# Altium schematic sheet Stabilizer_Piezo_Driver.SchDoc: Stabilizer Piezo
size 420 x 297 mm; CheckedBy: G. Kasprowicz; Author: Jakub Kajzer; CompanyName: WUT ISE; DrawnBy: Jakub Kajzer; Organization: WUT ISE; Address1: PW ISE; Address2: Nowowiejska 15/19 00-665 Warsaw; Address3: gkasprow@gmail.com; DocumentNumber: 1; Revision: 2; SheetNumber: 1; SheetTotal: 7; ModifiedBy: -; CreateDate: 03.08.2020; CheckedDate: -; Title2: Driver mezzanine; DivGrp: WUT ISE; Designer: Jakub Kajzer; ModifiedDate: -; ProjectName: Sensor Box
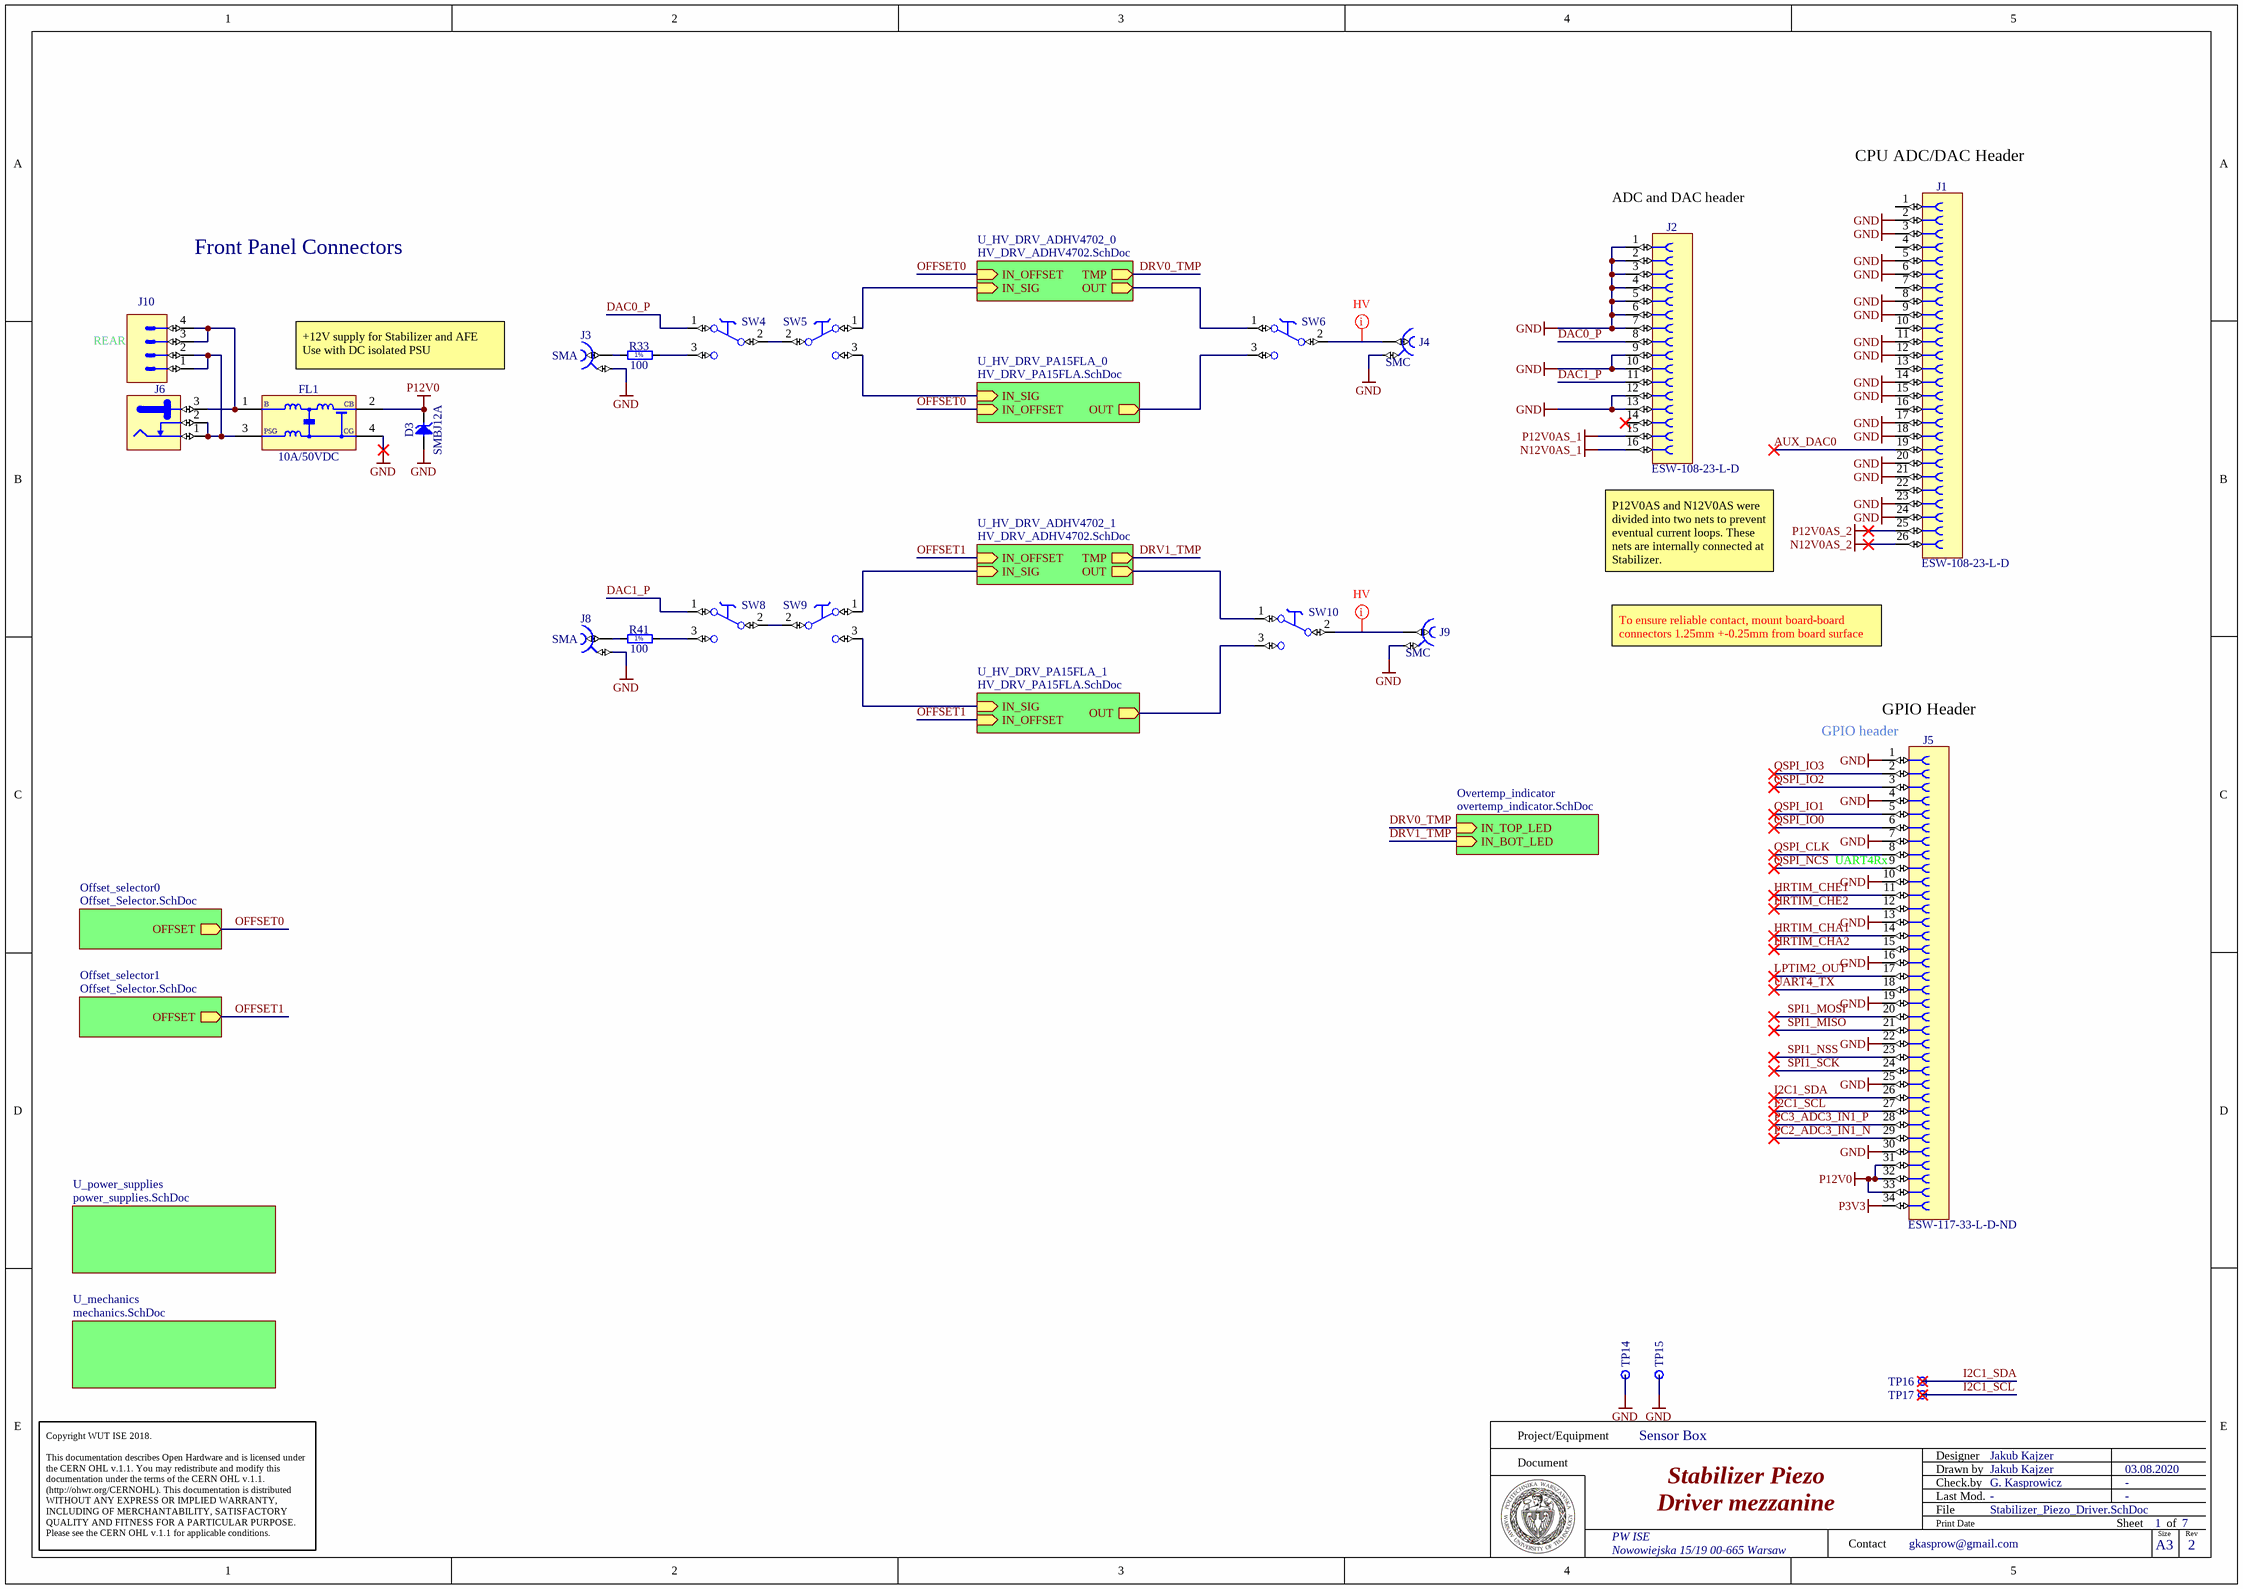
[diagram p0: Stabilizer_Piezo_Driver.SchDoc]

## Parts
D3  SMBJ12A  [DIOM5336X265N]
FL1  10A/50VDC  [FIL_MURATA_BNX02]
J1  ESW-108-23-L-D  [ESW-113-23-L-D]
J2  ESW-108-23-L-D  [ESW-108-23-L-D]
J3  SMA  [RF249BT0050GHDW]
J4  SMC  [JOHNSON_131-6701-341]
J5  Manufacturer Part Number: ESW-117-33-L-D-ND  [ESW-117-23-L-D]  (hidden comment: ESW-108-23-L-D)
J6  Jack  [SWITCHCRAFT_L712RA]  (value not drawn)
J8  SMA  [RF249BT0050GHDW]
J9  SMC  [JOHNSON_131-6701-341]
J10  Mini-Fit Jr.™  [MOLEX_39-30-0040]  (value not drawn)
R33  100  [RESC1005X40N]
R41  100  [RESC1005X40N]
SW4  Switch  [SW_C&K_1101M2S3CQE2]  (value not drawn)
SW5  Switch  [SW_C&K_1101M2S3CQE2]  (value not drawn)
SW6  Switch  [SW_C&K_1101M2S3CQE2]  (value not drawn)
SW8  Switch  [SW_C&K_1101M2S3CQE2]  (value not drawn)
SW9  Switch  [SW_C&K_1101M2S3CQE2]  (value not drawn)
SW10  Switch  [SW_C&K_1101M2S3CQE2]  (value not drawn)
TP14  Test Point  [TPS127]  (value not drawn)
TP15  Test Point  [TPS127]  (value not drawn)
TP16  Test Point  [TPS127]  (value not drawn)
TP17  Test Point  [TPS127]  (value not drawn)

## Sub-sheets
Offset_selector0 = Offset_Selector.SchDoc: OFFSET (out)
Offset_selector1 = Offset_Selector.SchDoc: OFFSET (out)
Overtemp_indicator = overtemp_indicator.SchDoc: IN_TOP_LED (in), IN_BOT_LED (in)
U_HV_DRV_ADHV4702_0 = HV_DRV_ADHV4702.SchDoc: OUT (out), TMP (out), IN_SIG (in), IN_OFFSET (in)
U_HV_DRV_ADHV4702_1 = HV_DRV_ADHV4702.SchDoc: OUT (out), TMP (out), IN_SIG (in), IN_OFFSET (in)
U_HV_DRV_PA15FLA_0 = HV_DRV_PA15FLA.SchDoc: OUT (out), IN_SIG (in), IN_OFFSET (in)
U_HV_DRV_PA15FLA_1 = HV_DRV_PA15FLA.SchDoc: OUT (out), IN_OFFSET (in), IN_SIG (in)
U_mechanics = mechanics.SchDoc: no entries
U_power_supplies = power_supplies.SchDoc: no entries

## Nets
GND: D3.2(A) FL1.4(CG) J1.2 J1.3 J1.5 J1.6 J1.8 J1.9 J1.11 J1.12 J1.14 J1.15 J1.17 J1.18 J1.20 J1.21 J1.23 J1.24 J2.1 J2.2 J2.3 J2.4 J2.5 J2.6 J2.7 J2.9 J2.10 J2.12 J2.13 J3.2 J4.2 J5.1 J5.4 J5.7 J5.10 J5.13 J5.16 J5.19 J5.22 J5.25 J5.30 J8.2 J9.2 TP14.1 TP15.1
N12V0AS_1: J2.16
N12V0AS_2: J1.26
P3V3: J5.34
P12V0: D3.1(C) FL1.2(CB) J5.31 J5.32 J5.33
P12V0AS_1: J2.15
P12V0AS_2: J1.25
AUX_DAC0: J1.19
DAC0_P: J2.8 SW4.1(NC)
DAC1_P: J2.11 SW8.1(NC)
DRV0_TMP: sheet Overtemp_indicator/IN_TOP_LED, sheet U_HV_DRV_ADHV4702_0/TMP
DRV1_TMP: sheet U_HV_DRV_ADHV4702_1/TMP, sheet Overtemp_indicator/IN_BOT_LED
HRTIM_CHA1: J5.14
HRTIM_CHA2: J5.15
HRTIM_CHE1: J5.11
HRTIM_CHE2: J5.12
I2C1_SCL: J5.27 TP17.1
I2C1_SDA: J5.26 TP16.1
LPTIM2_OUT: J5.17
OFFSET0: sheet U_HV_DRV_PA15FLA_0/IN_OFFSET, sheet Offset_selector0/OFFSET, sheet U_HV_DRV_ADHV4702_0/IN_OFFSET
OFFSET1: sheet U_HV_DRV_ADHV4702_1/IN_OFFSET, sheet U_HV_DRV_PA15FLA_1/IN_OFFSET, sheet Offset_selector1/OFFSET
PC2_ADC3_IN1_N: J5.29
PC3_ADC3_IN1_P: J5.28
QSPI_CLK: J5.8
QSPI_IO0: J5.6
QSPI_IO1: J5.5
QSPI_IO2: J5.3
QSPI_IO3: J5.2
QSPI_NCS: J5.9
SPI1_MISO: J5.21
SPI1_MOSI: J5.20
SPI1_NSS: J5.23
SPI1_SCK: J5.24
UART4_TX: J5.18
NetFL1_1: FL1.1(B) J6.3 J10.3 J10.4
NetFL1_3: FL1.3(PSG) J6.1 J6.2 J10.1 J10.2
NetJ3_1: J3.1 R33.1
NetJ4_1: J4.1 SW6.2(C)
NetJ8_1: J8.1 R41.1
NetJ9_1: J9.1 SW10.2(C)
NetR33_2: R33.2 SW4.3(NO)
NetR41_2: R41.2 SW8.3(NO)
NetSW4_2: SW4.2(C) SW5.2(C)
NetSW5_1: SW5.1(NC) ; sheet U_HV_DRV_ADHV4702_0/IN_SIG
NetSW5_3: SW5.3(NO) ; sheet U_HV_DRV_PA15FLA_0/IN_SIG
NetSW6_1: SW6.1(NC) ; sheet U_HV_DRV_ADHV4702_0/OUT
NetSW6_3: SW6.3(NO) ; sheet U_HV_DRV_PA15FLA_0/OUT
NetSW8_2: SW8.2(C) SW9.2(C)
NetSW9_1: SW9.1(NC) ; sheet U_HV_DRV_ADHV4702_1/IN_SIG
NetSW9_3: SW9.3(NO) ; sheet U_HV_DRV_PA15FLA_1/IN_SIG
NetSW10_1: SW10.1(NC) ; sheet U_HV_DRV_ADHV4702_1/OUT
NetSW10_3: SW10.3(NO) ; sheet U_HV_DRV_PA15FLA_1/OUT

Not connected (* = marked no-connect by the designer): J1 1 4 7 10 13 16 22; J2 14*

## Layout directives
net class HV: NetJ4_1, NetJ9_1

## Notes on the sheet
- (near J1) CPU ADC/DAC Header
- Front Panel Connectors
- (near J2) ADC and DAC header
- (near J10) REAR
- +12V supply for Stabilizer and AFE
  Use with DC isolated PSU
- (near J2) P12V0AS and N12V0AS were divided into two nets to prevent eventual current loops. These nets are internally connected at Stabilizer.
- To ensure reliable contact, mount board-board connectors 1.25mm +-0.25mm from board surface
- (near J5) GPIO Header
- (near J5) GPIO header
- (near J5) UART4Rx
- Project/Equipment
- Document
- Designer
- Drawn by
- Check.by
- Copyright WUT ISE 2018.
  This documentation describes Open Hardware and is licensed under the CERN OHL v.1.1. You may redistribute and modify this documentation under the terms of the CERN OHL v.1.1. (http://ohwr.org/CERNOHL). This documentation is distributed WITHOUT ANY EXPRESS OR IMPLIED WARRANTY, INCLUDING OF MERCHANTABILITY, SATISFACTORY QUALITY AND FITNESS FOR A PARTICULAR PURPOSE. Please see the CERN OHL v.1.1 for applicable conditions.
- Contact
- File
- Last Mod.
- Print Date
- Sheet
- Size
- A3
- of
- Rev
- (in symbol R0402_100R_1%_0.0625W_100PPM) 1%

## Library data of the parts
D3 = SMBJ12A: Zener Diode; Part Description: Uni-Directional Transient Voltage Suppressor Diode; Manufacturer: FAIRCHILD SEMICONDUCTOR; Voltage: 12V; Power: 600W; PressFit: No; Bonding: No; Part Number: SMBJ12A; Component Kind: Standard; Component Type: Standard; Device: SMBJ12A; PackageDescription: DO-214-AA/SMB Diode, Molded Body; 5.34mm L X 3.625mm W X 2.65mm H, IPC Medium Density; Manufacturer Part Number: SMBJ12A; Pin Count: 2; Case: DO-214AA; Mounted: Yes; Socket: No; SMD: Yes; Sense: No; ComponentHeight: 2.65mm; HelpURL: \\cern.ch\dfs\Applications\Altium\Datasheets\SMBJ.pdf; Author: CERN DEM JLC; CreateDate: 10/04/2013; LatestRevisionDate: 10/04/2013
FL1 = FIL_MURATA_BNX022-01L: Block Type EMIFIL (LC Combined); Part Description: Block Type EMIFIL (LC Combined) SMD Type, BNX02* Series; Manufacturer: MURATA; Resistance: 0.5R; Part Number: FIL_MURATA_BNX022-01L; Component Kind: Standard; Component Type: Standard; Pin Count: 2; Value: 10A/50VDC; Status: None; Manufacturer Part Number: BNX022-01L; Mounted: Yes; Socket: No; SMD: Yes; Sense: No; ComponentHeight: 3.3mm; HelpURL: \\cern.ch\dfs\Applications\Altium\Datasheets\FIL_MURATA_BNX022-01L.pdf; Author: CERN DEM JLC; CreateDate: 10/10/2012; LatestRevisionDate: 10/10/2012
J1 = ESW-113-23-L-D: Connector Elevated Socket 26 POS 2.54mm, 13.59mm height; Manufacturer: Samtec; Manufacturer Part Number: ESW-108-23-L-D
J2 = ESW-108-23-L-D: Connector Elevated Socket 16 POS 2.54mm, 13.59mm height; Manufacturer: Samtec; Manufacturer Part Number: ESW-108-23-L-D
J3 J8 = CON_SMA_RF249BT0050GHDW: 50 Ohm Through Hole SMA Right Angle PCB Jack; Part Number: AdamTech_RF249BT0050GHDW; Manufacturer: AdamTech; PressFit: No; Component Kind: Standard; Component Type: Standard; Pin Count: 5; Family: SMA; Mounted: Yes; Socket: No; SMD: No; Sense: No; Status: None; Part Description: 50 Ohm Through Hole SMA Right Angle PCB Jack; Manufacturer Part Number: RF249BT0050GHDW; ComponentHeight: 10.44mm; HelpURL: \\cern.ch\dfs\Applications\Altium\Datasheets\AMPHENOL_132203.pdf; Author: GK; CreateDate: 06.10.2016; LatestRevisionDate: 06.10.2016
J4 J9 = JOHNSON_131-6701-341: Part Description: SMC 50 Ohms Right Angle Bulkhead Jack Receptacle; PressFit: No; Part Number: JOHNSON_131-6701-341; Component Kind: Standard; Component Type: Standard; Pin Count: 2; Family: SMC; Mounted: Yes; Socket: No; SMD: No; Sense: No; Status: None; Manufacturer: JOHNSON; Manufacturer Part Number: 131-6701-341; ComponentHeight: 7.67mm; HelpURL: \\cern.ch\dfs\Applications\Altium\Datasheets\JOHNSON_131-6701-341.pdf; Author: CERN DEM JLC; CreateDate: 16.02.2010; LatestRevisionDate: 12.01.2017
J5 = ESW-117-23-L-D: Connector Elevated Socket 34 POS 2.54mm, 13.59mm height; Manufacturer: Samtec
J6 = SWITCHCRAFT_L712RA: 24V /3. 5A, 2.1mm Diameter Pin, SMD DC Power Supply Connector With  Break Contact; Part Description: 12V/5A, 2.5mm Diameter Pin, THT DC Power Supply Connector With  Break Contact; Manufacturer Part Number: L712RA; PressFit: No; Part Number: SWITCHCRAFT_L712RA; Component Kind: Standard; Component Type: Standard; Pin Count: 3; Family: Jack; Mounted: Yes; Socket: No; SMD: No; Sense: No; Status: None; Manufacturer: SWITCHCRAFT; ComponentHeight: 11mm; HelpURL: \\cern.ch\dfs\Applications\Altium\Datasheets\LUMBERG_161314.pdf; Author: GK; CreateDate: 15.02.2011; LatestRevisionDate: 20.07.2011
J10 = MOLEX_39-30-0040: Connector 4 Male; Part Description: 4.20mm (.165") Pitch Mini-Fit Jr. Header, Dual Row, Right Angle with Snap-in Plastic Peg PCB Lock, 4 Circuits; Manufacturer: MOLEX; PressFit: No; Part Number: MOLEX_39-30-0040; Component Kind: Standard; Component Type: Standard; Pin Count: 4; Family: Mini-Fit Jr.™; Mounted: Yes; Socket: No; SMD: No; Sense: No; Status: None; Manufacturer Part Number: 39-30-0040; ComponentHeight: 11.4mm; HelpURL: \\cern.ch\dfs\Applications\Altium\Datasheets\MOLEX_39-30-0040.pdf; Author: CERN DEM JLC; CreateDate: 02/10/2018; LatestRevisionDate: 02/10/2018
R33 R41 = R0402_100R_1%_0.0625W_100PPM: Resistor - 1%; Part Description: General Purpose Thick Film Chip Resistor; Manufacturer: GENERIC; Manufacturer1 Part Number: 232270671001L; TC: ±100ppm/°C; PressFit: No; Part Number: R0402_100R_1%_0.0625W_100PPM; Component Kind: Standard; Component Type: Standard; Pin Count: 2; Value: 100; Status: Not Recommended; Power: 0.0625W; Tolerance: ±1%; Manufacturer Part Number: R0402_100R_1%_0.0625W_100PPM; Case: 0402; Mounted: Yes; Sense: No; Socket: No; SMD: Yes; Manufacturer1 Example: YAGEO PHYCOMP; Manufacturer1 ComponentHeight: 0.4mm; HelpURL: \\cern.ch\dfs\Applications\Altium\Datasheets\R0402_Phycomp_RC0402.pdf; Author: CERN DEM JLC; CreateDate: 03.12.2007; LatestRevisionDate: 17.10.2012
SW4-SW6 SW8-SW10 = SW_C&K_1101M2S3CQE2: SPDT Switch; Part Description: PC Thru-Hole SPDT Slide Switch, .200" High Actuator, C&K 1000 Series; Manufacturer: C&K; PressFit: No; Sense Comment: Non-washable; Part Number: SW_C&K_1101M2S3CQE2; Component Kind: Standard; Component Type: Standard; Pin Count: 3; PackageDescription: PC Thru-Hole SPDT Slide Switch, .200" High Actuator, C&K 1000 Series; Family: Switch; Mounted: Yes; Socket: No; SMD: No; Sense: Yes; Status: None; Manufacturer Part Number: 1101M2S3CQE2; ComponentHeight: 13.34mm; HelpURL: \\cern.ch\dfs\Applications\Altium\Datasheets\SW_C&K_1101M2S3CQE2.pdf; Author: CERN DEM BC; CreateDate: 30.01.2019; LatestRevisionDate: 30.01.2019
TP14-TP17 = SMD_PAD_1.27X1.27MM: Part Description: 1.27mm x 1.27mm PCB Copper Area (SMD Test Point); Mounted: No; Part Number: SMD_PAD_1.27X1.27MM; Component Kind: Standard (No BOM); Component Type: Standard (No BOM); Pin Count: 1; Family: Test Point; Socket: No; SMD: Yes; Sense: No; Status: None; ComponentHeight: 0mm; HelpURL: Undefined; Author: CERN DEM JLC; CreateDate: 12/01/2008; LatestRevisionDate: 12/01/2008; PackageDescription: 1.27mm x 1.27mm PCB Copper Area (SMD Test Point)